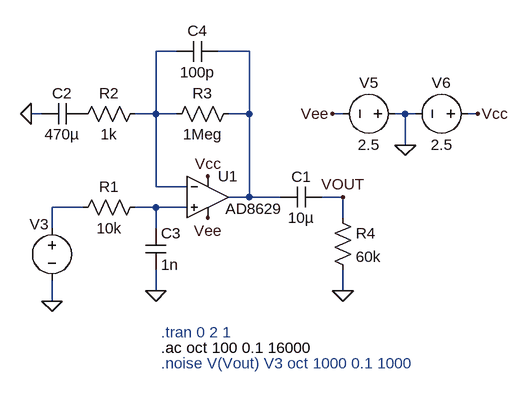
[diagram p0: schematic ac_amp.asc]
ac_amp.asc, the LTspice schematic file:
Version 4.1
SHEET 1 1924 680
WIRE -160 -32 -192 -32
WIRE -48 -32 -96 -32
WIRE -368 64 -384 64
WIRE -192 64 -192 -32
WIRE -192 64 -224 64
WIRE -160 64 -192 64
WIRE -48 64 -48 -32
WIRE -48 64 -80 64
WIRE 96 64 80 64
WIRE 192 64 176 64
WIRE 208 64 192 64
WIRE 304 64 288 64
WIRE 192 112 192 64
WIRE -192 176 -192 64
WIRE -144 176 -192 176
WIRE -48 192 -48 64
WIRE -48 192 -80 192
WIRE 0 192 -48 192
WIRE 96 192 64 192
WIRE -304 208 -352 208
WIRE -192 208 -224 208
WIRE -144 208 -192 208
WIRE 96 224 96 192
WIRE -352 240 -352 208
WIRE -192 240 -192 208
WIRE -192 336 -192 304
WIRE 96 336 96 304
WIRE -352 352 -352 320
FLAG 192 112 0
FLAG 304 64 Vcc
FLAG 80 64 Vee
FLAG -352 352 0
FLAG -112 160 Vcc
FLAG -112 224 Vee
FLAG 96 336 0
FLAG 96 192 VOUT
FLAG -192 336 0
FLAG -384 64 0
SYMBOL cap 64 176 R90
WINDOW 0 0 32 VBottom 2
WINDOW 3 32 32 VTop 2
SYMATTR InstName C1
SYMATTR Value 10µ
SYMBOL voltage -352 224 R0
WINDOW 0 -34 10 Left 2
WINDOW 3 24 96 Invisible 2
SYMATTR InstName V3
SYMATTR Value SINE(200m 100u 10)
SYMATTR SpiceLine Rser=0
SYMATTR Value2 AC 1m
SYMBOL res -64 48 R90
WINDOW 0 0 56 VBottom 2
WINDOW 3 32 56 VTop 2
SYMATTR InstName R3
SYMATTR Value 1Meg
SYMBOL res -208 192 R90
WINDOW 0 0 56 VBottom 2
WINDOW 3 32 56 VTop 2
SYMATTR InstName R1
SYMATTR Value 10k
SYMBOL res -208 48 R90
WINDOW 0 0 56 VBottom 2
WINDOW 3 32 56 VTop 2
SYMATTR InstName R2
SYMATTR Value 1k
SYMBOL cap -96 -48 R90
WINDOW 0 0 32 VBottom 2
WINDOW 3 32 32 VTop 2
SYMATTR InstName C4
SYMATTR Value 100p
SYMBOL voltage 192 64 R90
WINDOW 0 -32 56 VBottom 2
WINDOW 3 32 56 VTop 2
WINDOW 123 0 0 Left 0
WINDOW 39 0 0 Left 0
SYMATTR InstName V5
SYMATTR Value 2.5
SYMBOL voltage 304 64 R90
WINDOW 0 -32 56 VBottom 2
WINDOW 3 32 56 VTop 2
WINDOW 123 0 0 Left 0
WINDOW 39 0 0 Left 0
SYMATTR InstName V6
SYMATTR Value 2.5
SYMBOL res 80 208 R0
SYMATTR InstName R4
SYMATTR Value 60k
SYMBOL OpAmps\\AD8629 -112 128 R0
WINDOW 3 27 82 Left 2
SYMATTR InstName U1
SYMBOL cap -304 48 R90
WINDOW 0 0 32 VBottom 2
WINDOW 3 32 32 VTop 2
SYMATTR InstName C2
SYMATTR Value 470µ
SYMBOL cap -208 240 R0
SYMATTR InstName C3
SYMATTR Value 1n
TEXT -184 400 Left 2 ;.tran 0 2 1
TEXT -184 424 Left 2 !.ac oct 100 0.1 16000
TEXT -184 448 Left 2 ;.noise V(Vout) V3 oct 1000 0.1 1000

The netlist it stands for:
* ac_amp.asc
C1 VOUT N002 10µ
V3 N003 0 SINE(200m 100u 10) AC 1m Rser=0
R3 N002 N001 1Meg
R1 N004 N003 10k
R2 N001 P001 1k
C4 N002 N001 100p
V5 0 Vee 2.5
V6 Vcc 0 2.5
R4 VOUT 0 60k
X§U1 N004 N001 Vcc Vee N002 AD8629  ; pins In+ In- V+ V- OUT
C2 P001 0 470µ
C3 N004 0 1n
* .tran 0 2 1
.ac oct 100 0.1 16000
* .noise V(Vout) V3 oct 1000 0.1 1000
.backanno
.end